# Altium schematic sheet System_Overview_HP.SchDoc
size B; SheetNumber: 3; SheetTotal: 12; PageSetup: Record=PageOptions|CenterHorizontal=True|CenterVertical=True|PrintScale=0.97|XCorrection=1.00|YCorrection=1.00|PrintKind=0|BorderSize=5000000|LeftOffset=0|BottomOffset=0|Orientation=2|PaperLength=1000|PaperWidth=1000|Scale=100|PaperSource=7|PrintQuality=-3|MediaType=1|DitherType=10|PrintScaleMode=1|PaperKind=A4|PaperIndex=9
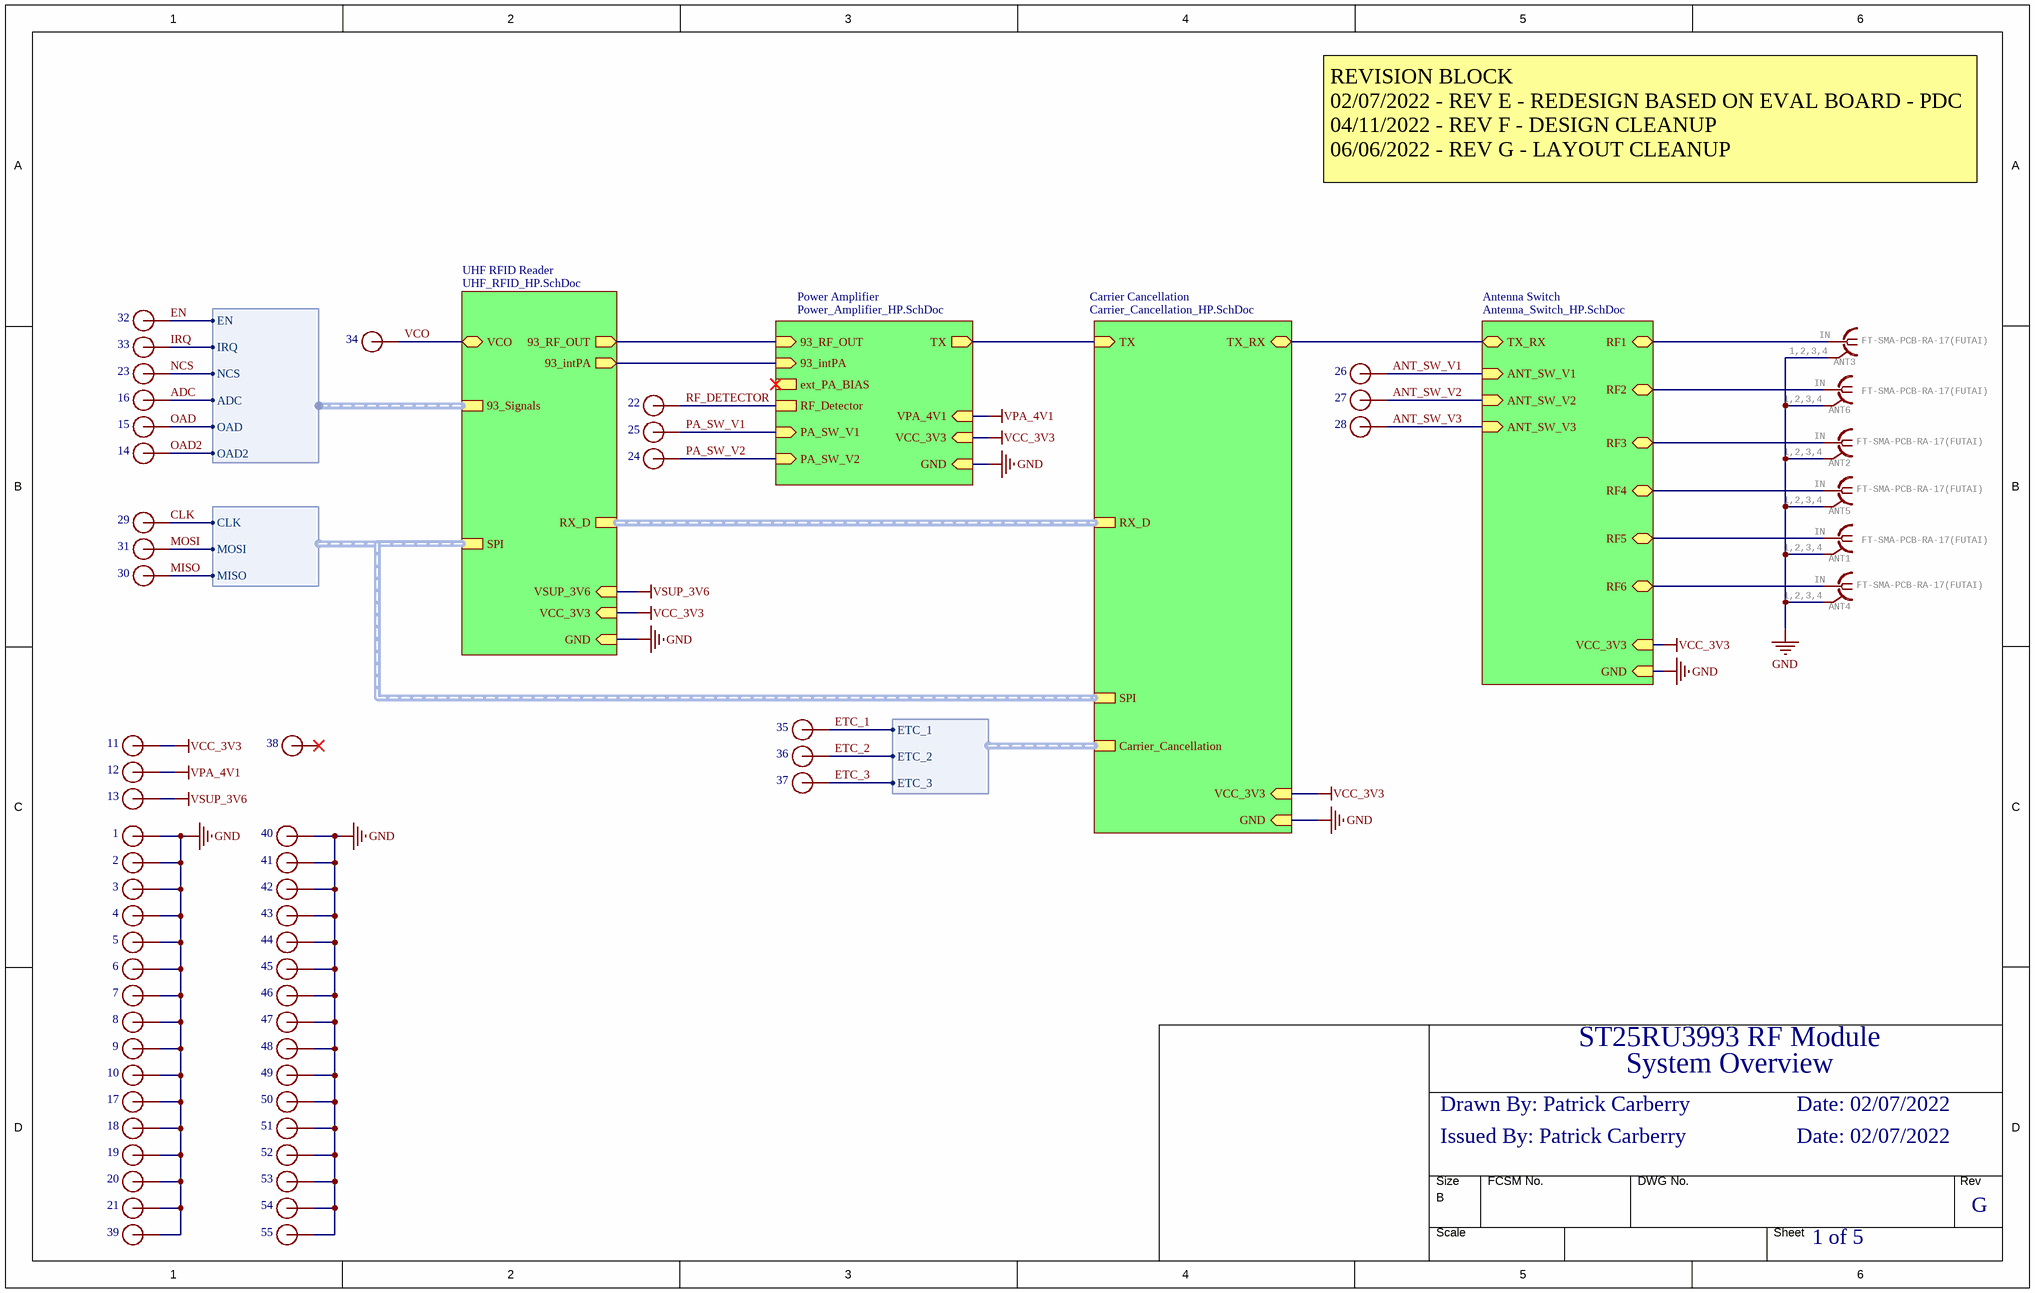
[diagram p0: System_Overview_HP.SchDoc]

## Parts
1  1-PIN-HDR-GEN  [1X01-PIN]  (value not drawn)
2  1-PIN-HDR-GEN  [1X01-PIN]  (value not drawn)
3  1-PIN-HDR-GEN  [1X01-PIN]  (value not drawn)
4  1-PIN-HDR-GEN  [1X01-PIN]  (value not drawn)
5  1-PIN-HDR-GEN  [1X01-PIN]  (value not drawn)
6  1-PIN-HDR-GEN  [1X01-PIN]  (value not drawn)
7  1-PIN-HDR-GEN  [1X01-PIN]  (value not drawn)
8  1-PIN-HDR-GEN  [1X01-PIN]  (value not drawn)
9  1-PIN-HDR-GEN  [1X01-PIN]  (value not drawn)
10  1-PIN-HDR-GEN  [1X01-PIN]  (value not drawn)
11  1-PIN-HDR-GEN  [1X01-PIN]  (value not drawn)
12  1-PIN-HDR-GEN  [1X01-PIN]  (value not drawn)
13  1-PIN-HDR-GEN  [1X01-PIN]  (value not drawn)
14  1-PIN-HDR-GEN  [1X01-PIN]  (value not drawn)
15  1-PIN-HDR-GEN  [1X01-PIN]  (value not drawn)
16  1-PIN-HDR-GEN  [1X01-PIN]  (value not drawn)
17  1-PIN-HDR-GEN  [1X01-PIN]  (value not drawn)
18  1-PIN-HDR-GEN  [1X01-PIN]  (value not drawn)
19  1-PIN-HDR-GEN  [1X01-PIN]  (value not drawn)
20  1-PIN-HDR-GEN  [1X01-PIN]  (value not drawn)
21  1-PIN-HDR-GEN  [1X01-PIN]  (value not drawn)
22  1-PIN-HDR-GEN  [1X01-PIN]  (value not drawn)
23  1-PIN-HDR-GEN  [1X01-PIN]  (value not drawn)
24  1-PIN-HDR-GEN  [1X01-PIN]  (value not drawn)
25  1-PIN-HDR-GEN  [1X01-PIN]  (value not drawn)
26  1-PIN-HDR-GEN  [1X01-PIN]  (value not drawn)
27  1-PIN-HDR-GEN  [1X01-PIN]  (value not drawn)
28  1-PIN-HDR-GEN  [1X01-PIN]  (value not drawn)
29  1-PIN-HDR-GEN  [1X01-PIN]  (value not drawn)
30  1-PIN-HDR-GEN  [1X01-PIN]  (value not drawn)
31  1-PIN-HDR-GEN  [1X01-PIN]  (value not drawn)
32  1-PIN-HDR-GEN  [1X01-PIN]  (value not drawn)
33  1-PIN-HDR-GEN  [1X01-PIN]  (value not drawn)
34  1-PIN-HDR-GEN  [1X01-PIN]  (value not drawn)
35  1-PIN-HDR-GEN  [1X01-PIN]  (value not drawn)
36  1-PIN-HDR-GEN  [1X01-PIN]  (value not drawn)
37  1-PIN-HDR-GEN  [1X01-PIN]  (value not drawn)
38  1-PIN-HDR-GEN  [1X01-PIN]  (value not drawn)
39  1-PIN-HDR-GEN  [1X01-PIN]  (value not drawn)
40  1-PIN-HDR-GEN  [1X01-PIN]  (value not drawn)
41  1-PIN-HDR-GEN  [1X01-PIN]  (value not drawn)
42  1-PIN-HDR-GEN  [1X01-PIN]  (value not drawn)
43  1-PIN-HDR-GEN  [1X01-PIN]  (value not drawn)
44  1-PIN-HDR-GEN  [1X01-PIN]  (value not drawn)
45  1-PIN-HDR-GEN  [1X01-PIN]  (value not drawn)
46  1-PIN-HDR-GEN  [1X01-PIN]  (value not drawn)
47  1-PIN-HDR-GEN  [1X01-PIN]  (value not drawn)
48  1-PIN-HDR-GEN  [1X01-PIN]  (value not drawn)
49  1-PIN-HDR-GEN  [1X01-PIN]  (value not drawn)
50  1-PIN-HDR-GEN  [1X01-PIN]  (value not drawn)
51  1-PIN-HDR-GEN  [1X01-PIN]  (value not drawn)
52  1-PIN-HDR-GEN  [1X01-PIN]  (value not drawn)
53  1-PIN-HDR-GEN  [1X01-PIN]  (value not drawn)
54  1-PIN-HDR-GEN  [1X01-PIN]  (value not drawn)
55  1-PIN-HDR-GEN  [1X01-PIN]  (value not drawn)
ANT1  FT-SMA-PCB-RA-17(FUTAI)  [FT-SMA-PCB-RA-17]
ANT2  FT-SMA-PCB-RA-17(FUTAI)  [FT-SMA-PCB-RA-17]
ANT3  FT-SMA-PCB-RA-17(FUTAI)  [FT-SMA-PCB-RA-17]
ANT4  FT-SMA-PCB-RA-17(FUTAI)  [FT-SMA-PCB-RA-17]
ANT5  FT-SMA-PCB-RA-17(FUTAI)  [FT-SMA-PCB-RA-17]
ANT6  FT-SMA-PCB-RA-17(FUTAI)  [FT-SMA-PCB-RA-17]

## Sub-sheets
Antenna Switch = Antenna_Switch_HP.SchDoc: ANT_SW_V2 (in), TX_RX (bidir), ANT_SW_V1 (in), ANT_SW_V3 (in), GND (in), VCC_3V3 (in), RF1 (bidir), RF6 (bidir), RF4 (bidir), RF3 (bidir), RF5 (bidir), RF2 (bidir)
Carrier Cancellation = Carrier_Cancellation_HP.SchDoc: TX (in), Carrier_Cancellation (harness Harness_CC), SPI (harness Harness_SPI), RX_D (harness Harness_RX_D), TX_RX (bidir), GND (in), VCC_3V3 (in)
Power Amplifier = Power_Amplifier_HP.SchDoc: 93_RF_OUT (in), TX (out), PA_SW_V2 (in), RF_Detector, 93_intPA (in), ext_PA_BIAS, PA_SW_V1 (in), GND (in), VCC_3V3 (in), VPA_4V1 (in)
UHF RFID Reader = UHF_RFID_HP.SchDoc: 93_RF_OUT (out), SPI (harness Harness_SPI), 93_Signals (harness Harness_93), RX_D (harness Harness_RX_D), 93_intPA (out), VCO (bidir), VCC_3V3 (in), VSUP_3V6 (in), GND (in)

## Harnesses
Harness_SPI: MISO, MOSI, CLK
Harness_CC: ETC_1, ETC_2, ETC_3
Harness_93: IRQ, EN, NCS, ADC, OAD, OAD2

## Nets
GND: 1.1(P$1) 2.1(P$1) 3.1(P$1) 4.1(P$1) 5.1(P$1) 6.1(P$1) 7.1(P$1) 8.1(P$1) 9.1(P$1) 10.1(P$1) 17.1(P$1) 18.1(P$1) 19.1(P$1) 20.1(P$1) 21.1(P$1) 39.1(P$1) 40.1(P$1) 41.1(P$1) 42.1(P$1) 43.1(P$1) 44.1(P$1) 45.1(P$1) 46.1(P$1) 47.1(P$1) 48.1(P$1) 49.1(P$1) 50.1(P$1) 51.1(P$1) 52.1(P$1) 53.1(P$1) 54.1(P$1) 55.1(P$1) ANT1.1,2,3,4(P$2) ANT2.1,2,3,4(P$2) ANT3.1,2,3,4(P$2) ANT4.1,2,3,4(P$2) ANT5.1,2,3,4(P$2) ANT6.1,2,3,4(P$2) ; sheet UHF RFID Reader/GND, sheet Power Amplifier/GND, sheet Carrier Cancellation/GND, sheet Antenna Switch/GND
VCC_3V3: 11.1(P$1) ; sheet UHF RFID Reader/VCC_3V3, sheet Power Amplifier/VCC_3V3, sheet Carrier Cancellation/VCC_3V3, sheet Antenna Switch/VCC_3V3
VPA_4V1: 12.1(P$1) ; sheet Power Amplifier/VPA_4V1
VSUP_3V6: 13.1(P$1) ; sheet UHF RFID Reader/VSUP_3V6
ADC: 16.1(P$1) ; sheet UHF RFID Reader/93_Signals.ADC
ANT_SW_V1: 26.1(P$1) ; sheet Antenna Switch/ANT_SW_V1
ANT_SW_V2: 27.1(P$1) ; sheet Antenna Switch/ANT_SW_V2
ANT_SW_V3: 28.1(P$1) ; sheet Antenna Switch/ANT_SW_V3
CLK: 29.1(P$1) ; sheet UHF RFID Reader/SPI.CLK
EN: 32.1(P$1) ; sheet UHF RFID Reader/93_Signals.EN
ETC_1: 35.1(P$1) ; sheet Carrier Cancellation/Carrier_Cancellation.ETC_1
ETC_2: 36.1(P$1) ; sheet Carrier Cancellation/Carrier_Cancellation.ETC_2
ETC_3: 37.1(P$1) ; sheet Carrier Cancellation/Carrier_Cancellation.ETC_3
IRQ: 33.1(P$1) ; sheet UHF RFID Reader/93_Signals.IRQ
MISO: 30.1(P$1) ; sheet UHF RFID Reader/SPI.MISO
MOSI: 31.1(P$1) ; sheet UHF RFID Reader/SPI.MOSI
NCS: 23.1(P$1) ; sheet UHF RFID Reader/93_Signals.NCS
OAD: 15.1(P$1) ; sheet UHF RFID Reader/93_Signals.OAD
OAD2: 14.1(P$1) ; sheet UHF RFID Reader/93_Signals.OAD2
PA_SW_V1: 25.1(P$1) ; sheet Power Amplifier/PA_SW_V1
PA_SW_V2: 24.1(P$1) ; sheet Power Amplifier/PA_SW_V2
RF_DETECTOR: 22.1(P$1) ; sheet Power Amplifier/RF_Detector
VCO: 34.1(P$1) ; sheet UHF RFID Reader/VCO
NetANT1_IN: ANT1.IN(P$1) ; sheet Antenna Switch/RF5
NetANT2_IN: ANT2.IN(P$1) ; sheet Antenna Switch/RF3
NetANT3_IN: ANT3.IN(P$1) ; sheet Antenna Switch/RF1
NetANT4_IN: ANT4.IN(P$1) ; sheet Antenna Switch/RF6
NetANT5_IN: ANT5.IN(P$1) ; sheet Antenna Switch/RF4
NetANT6_IN: ANT6.IN(P$1) ; sheet Antenna Switch/RF2
(unnamed): sheet UHF RFID Reader/93_RF_OUT, sheet Power Amplifier/93_RF_OUT
(unnamed): sheet UHF RFID Reader/93_intPA, sheet Power Amplifier/93_intPA
(unnamed): sheet Power Amplifier/TX, sheet Carrier Cancellation/TX
(unnamed): sheet Carrier Cancellation/TX_RX, sheet Antenna Switch/TX_RX

Not connected (* = marked no-connect by the designer): 38 1(P$1)*

## Buses and harness runs
harness sheet Carrier Cancellation/RX_D = sheet UHF RFID Reader/RX_D
harness sheet Carrier Cancellation/SPI = sheet UHF RFID Reader/SPI

## Notes on the sheet
- REVISION BLOCK
  02/07/2022 - REV E - REDESIGN BASED ON EVAL BOARD - PDC
  04/11/2022 - REV F - DESIGN CLEANUP
  06/06/2022 - REV G - LAYOUT CLEANUP
- Drawn By: Patrick Carberry
- ST25RU3993 RF Module
- System Overview
- Date: 02/07/2022
- Issued By: Patrick Carberry
- 1 of 5
- G

## Library data of the parts
1-55 = 1-PIN-HDR-GEN: Generic through hole; GateName_1: G$1; SymbolName_1: 1X1-GENERIC; LibraryName: Ziggi; DeviceSetName: 1-PIN-HDR-GEN
ANT1-ANT6 = FT-SMA-PCB-RA-17(FUTAI): Manufacturer: Futai HK CO; Manufacturer Part Number: FT-SMA-PCB-RA-26